# Altium schematic sheet Communication.SchDoc
size A4; SheetNumber: 4; SheetTotal: 5
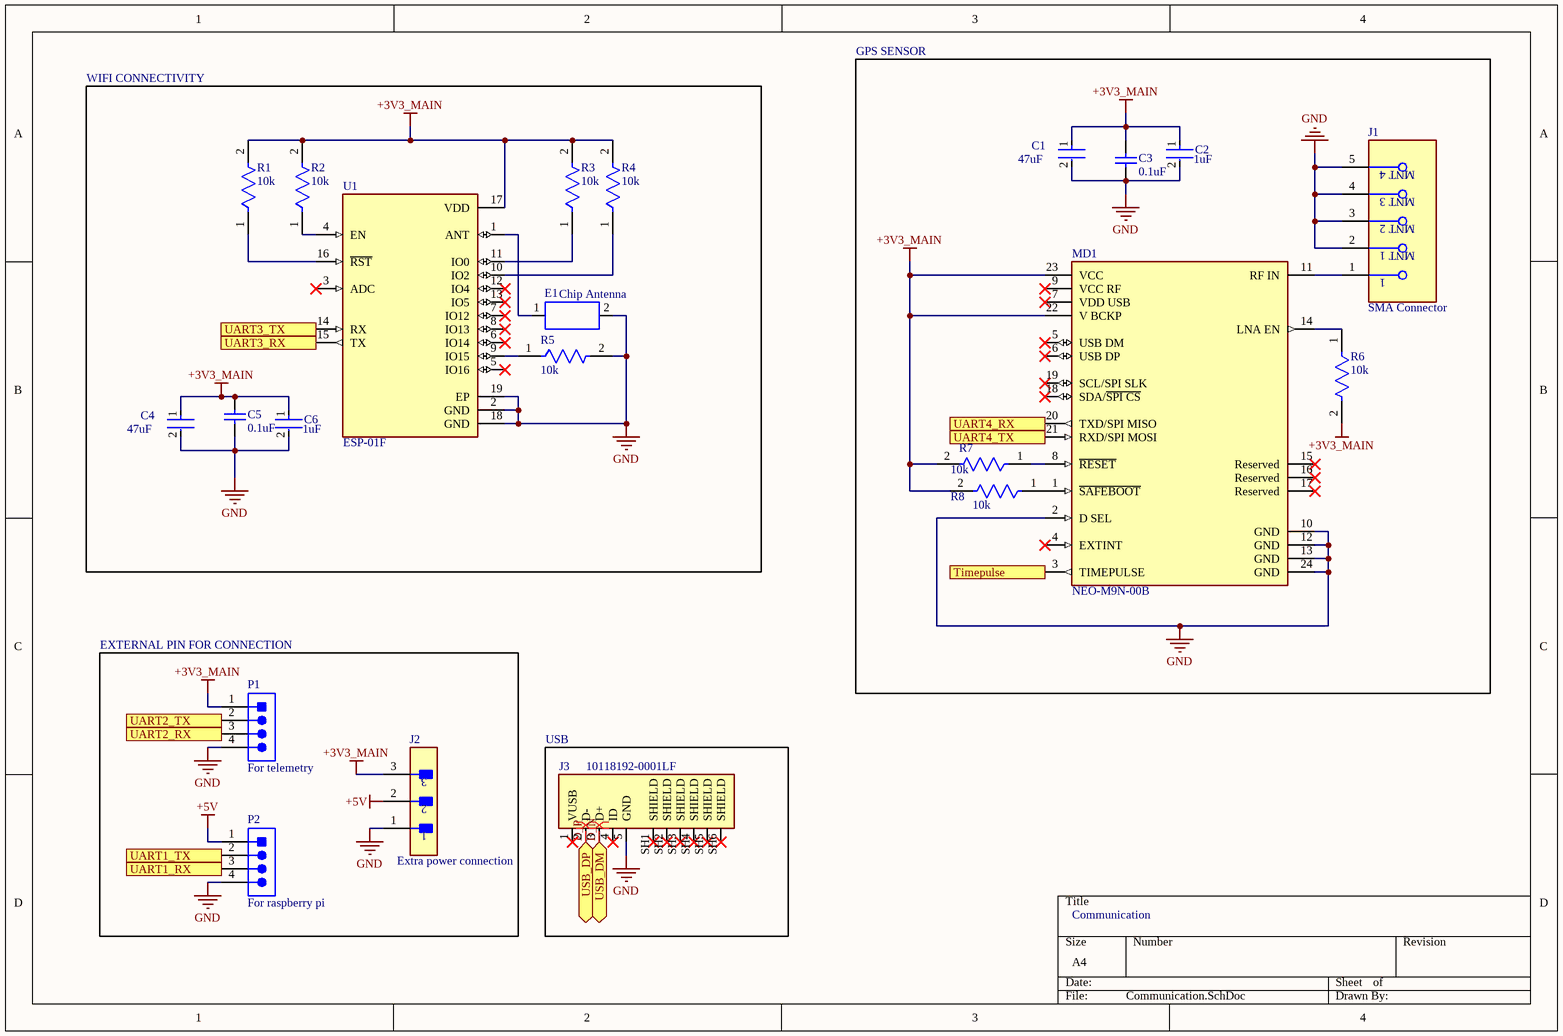
[diagram p0: Communication.SchDoc]

## Parts
C1  47uF  [FP-0603-L_1_6_0_2-W_0_8_0-MFG]
C2  1uF  [FP-GCJ21B-0_3-IPC_B]
C3  0.1uF  [CAPC1608X87X35ML15T15]
C4  47uF  [FP-0603-L_1_6_0_2-W_0_8_0-MFG]
C5  0.1uF  [CAPC1608X87X35ML15T15]
C6  1uF  [FP-GCJ21B-0_3-IPC_B]
E1  Chip Antenna  [TAYO-AH316M-2_M]
J1  SMA Connector  [FP-CON-SMA-EDGE-S-MFG]
J2  Extra power connection  [FP-B3B-XH-AM_LF_SN-MFG]
J3  10118192-0001LF  [AMPHENOL_10118192-0001LF]
MD1  NEO-M9N-00B  [FP-NEO-M9N-00B-MFG]
P1  For telemetry  [JST-B4B-EH-A_V]
P2  For raspberry pi  [JST-B4B-EH-A_V]
R1  10k  [FP-CRGP0805-IPC_C]
R2  10k  [FP-CRGP0805-IPC_C]
R3  10k  [FP-CRGP0805-IPC_C]
R4  10k  [FP-CRGP0805-IPC_C]
R5  10k  [FP-CRGP0805-IPC_C]
R6  10k  [FP-CRGP0805-IPC_C]
R7  10k  [FP-CRGP0805-IPC_C]
R8  10k  [FP-CRGP0805-IPC_C]
U1  ESP-01F  [MODULE_ESP-01F]

## Blocks framed on the sheet
WIFI CONNECTIVITY: C4-C6 E1 R1-R5 U1
GPS SENSOR: C1-C3 J1 MD1 R6-R8
EXTERNAL PIN FOR CONNECTION: J2 P1 P2
USB: J3

## Ports
Timepulse (out, see EMP_FC_Main[3B], MCU_Core[4B]), UART1_RX (out, see EMP_FC_Main[3B], MCU_Core[4B]), UART1_TX (in, see EMP_FC_Main[3B], MCU_Core[4B]), UART2_RX (out, see EMP_FC_Main[3B], MCU_Core[5B]), UART2_TX (in, see EMP_FC_Main[3B], MCU_Core[5B]), UART3_RX (out, see EMP_FC_Main[3B], MCU_Core[1B]), UART3_TX (in, see EMP_FC_Main[3B], MCU_Core[1B]), UART4_RX (out, see EMP_FC_Main[3B], MCU_Core[4B]), UART4_TX (in, see EMP_FC_Main[3B], MCU_Core[4B]), USB_DM (bidir, see EMP_FC_Main[3B], MCU_Core[4B]), USB_DP (bidir, see EMP_FC_Main[3B], MCU_Core[4B])

## Nets
+3V3_MAIN: C1.1 C2.1 C3.2 C4.1 C5.2 C6.1 J2.3 MD1.22(V_BCKP) MD1.23(VCC) P1.1 R1.2 R2.2 R3.2 R4.2 R6.2 R7.2 R8.2 U1.17(VDD)
+5V: J2.2 P2.1
GND: C1.2 C2.2 C3.1 C4.2 C5.1 C6.2 E1.2 J1.2(MNT_1) J1.3(MNT_2) J1.4(MNT_3) J1.5(MNT_4) J2.1 J3.5(GND) MD1.2(D_SEL) MD1.10(GND) MD1.12(GND) MD1.13(GND) MD1.24(GND) P1.4 P2.4 R5.2 U1.2(GND) U1.18(GND) U1.19(EP)
D_N: J3.3(D+) ; port USB_DM
D_P: J3.2(D-) ; port USB_DP
Timepulse: MD1.3(TIMEPULSE) ; port Timepulse
UART1_RX: P2.3 ; port UART1_RX
UART1_TX: P2.2 ; port UART1_TX
UART2_RX: P1.3 ; port UART2_RX
UART2_TX: P1.2 ; port UART2_TX
UART3_RX: U1.15(TX) ; port UART3_RX
UART3_TX: U1.14(RX) ; port UART3_TX
UART4_RX: MD1.20(TXD/SPI_MISO) ; port UART4_RX
UART4_TX: MD1.21(RXD/SPI_MOSI) ; port UART4_TX
NetE1_1: E1.1 U1.1(ANT)
NetJ1_1: J1.1 MD1.11(RF_IN)
NetMD1_1: MD1.1(~{SAFEBOOT}) R8.1
NetMD1_8: MD1.8(~{RESET}) R7.1
NetMD1_14: MD1.14(LNA_EN) R6.1
NetR1_1: R1.1 U1.16(~{RST})
NetR2_1: R2.1 U1.4(EN)
NetR3_1: R3.1 U1.11(IO0)
NetR4_1: R4.1 U1.10(IO2)
NetR5_1: R5.1 U1.9(IO15)

Not connected (* = marked no-connect by the designer): J3 1(VUSB)* 4(ID)* SH1(SHIELD)* SH2(SHIELD)* SH3(SHIELD)* SH4(SHIELD)* SH5(SHIELD)* SH6(SHIELD)*; MD1 4(EXTINT)* 5(USB_DM)* 6(USB_DP)* 7(VDD_USB)* 9(VCC_RF)* 15(Reserved)* 16(Reserved)* 17(Reserved)* 18(SDA/~{SPI_CS})* 19(SCL/SPI_SLK)*; U1 3(ADC)* 5(IO16)* 6(IO14)* 7(IO12)* 8(IO13)* 12(IO4)* 13(IO5)*

## Layout directives
differential pair: D_N, D_P

## Notes on the sheet
- Communication

## Library data of the parts
C1 C4 = CMP-14477-005318-1: Multilayer Ceramic Capacitor 47uF 4V X6S 20% SMD 0603 T/R
C2 C6 = CMP-06035-032003-1: Multilayer Ceramic Capacitors MLCC - SMD/SMT 0805 1uF 10%, 16VDC,  X8L +15/-40%
C3 C5 = CMP-2006-03295-1: Part Number: C0603T104K3RCLTU; Manufacturer: Kemet
E1 = CMP-00025-00001-2: Chip Antenna, 2.4 to 2.5 GHz, -40 to 85 degC, 2-Pin SMD, Pb-Free, Tape and Reel; Manufacturer: Taiyo Yuden; Frequency: 2.45GHz; Impedance: 50Ohm; Manufacturer URL: http://www.t-yuden.com/; Datasheet Version: Sep-15; Min Operating Temperature: -20°C; Mounting Technology: SM; RoHS Compliant: True; Case/Package: AH316M-2; Datasheet URL: http://www.yuden.co.jp/productdata/catalog/en/chipantenna01_e.pdf; Max Operating Temperature: 80°C; Package Quantity: 3000; Pins: 2; Packaging: TapeandReel; Package Description: 2-Pin Surface Mount Device, Body 3.2 x 1.6 mm; Package Reference: AH316M-2
J1 = CMP-204357-000001-1: CONN SMA JACK STR EDGE MNT; Manufacturer Part Number: CON-SMA-EDGE-S; Manufacturer: RF Solutions Ltd.; Impedance: 50Ω; Conn Orientation: Right Angle; Is Female: yes; Number Of Contacts: 1; Frequency: 18GHz; Shielding: true; Category: Conn; ComponentLink2URL: https://www.rfsolutions.co.uk/downloads/1498648656DS-CON-EDGE-SMA-4.pdf; Octopart: https://octopart.com/con-sma-edge-s-rf+solutions-70967450; Package: CONN_JACK; Height: 6.35mm; Device Class L1: Connectors; Footprint Url: https://forum.upverter.com/uploads/default/original/3X/b/e/be75b907af57498775929d6d9099689c472e0307.pdf; Contact Material: Gold; ComponentLink2Description: Datasheet; Device Class L2: RF / Coaxial Connectors; RoHS: TRUE; Device Class L3: unset; Digikey Description: CONN SMA JACK STR EDGE MNT; Lead Free: Yes; Automotive: No
J2 = CMP-17438-000009-1: CONN HEADER VERT 3POS 2.5MM; Max Current Rating: 3A; Gender: Male; Max Voltage Rating (AC): 250V; Connector Type: Male Pin; Pitch: 0.098inch; Number of Positions: 3; Contact Resistance: 20mR; Termination: Press-Fit; Housing Color: White; Housing Material: Polyamide; Orientation: Straight; Contact Material: Brass; Contact Type: Male Pin; Color: Natural; Packaging: Bulk; Lead Free: Lead Free; Depth: 5.75mm; Number of Rows: 1; Contact Plating: Tin; Length: 9.9mm; Max Operating Temperature: 85°C; Series: XH; Min Operating Temperature: -25°C; Fastening Type: Detent; Mount: Through Hole
J3 = 10118192-0001LF: Micro USB, Input Output Connectors, B TYPE RECEPTACLE with flange; MF: Amphenol ICC; Check_prices: https://www.snapeda.com/parts/10118192-0001LF/Amphenol+FCI/view-part/?ref=eda; Value: *; Availability: In Stock; MP: 10118192-0001LF; Price: None; Package: None; Purchase-URL: https://pricing.snapeda.com/search/part/10118192-0001LF/?ref=eda; SnapEDA_Link: https://www.snapeda.com/parts/10118192-0001LF/Amphenol+FCI/view-part/?ref=snap
MD1 = CMP-207130-000006-2: M9 standard precision module; Manufacturer: u-blox; Min Supply Voltage: 1.65V; Sensitivity: -167dBm; Interface: I2C,SPI,UART,USB; Max Supply Voltage: 3.6V; Device Class L3: RF Receivers; Category: UNK; Temperature Range Low: -40°C; Temperature Range High: +85°C; ComponentLink2Description: Datasheet; Manufacturer Part Number: NEO-M9N-00B; ComponentLink2URL: https://www.u-blox.com/sites/default/files/NEO-M9N_DataSheet_%28UBX-19014285%29.pdf; Footprint Url: https://www.u-blox.com/sites/default/files/NEO-M9N_Integrationmanual_%28UBX-19014286%29.pdf; Height: 2.6mm; Automotive: No; RoHS: TRUE; Lead Free: Yes; Octopart: https://octopart.com/neo-m9n-00b-u-blox-107315722; Package: 0; Temperature: -40°C to +85°C; Device Class L1: Integrated Circuits (ICs); Device Class L2: RF Semiconductors and Devices
P1 P2 = CMP-2000-05904-1: Male Header, Pitch 2.5 mm, 1 x 4 Position, Height 6 mm, Tail Length 3.2 mm, -25 to 85 degC, RoHS, Bulk; Manufacturer: JST; Style/Orientation: StraightHeader/Plug; Pitch: 2.5mm; No of Positions: 4; Mounting Technology: SurfaceMount; Package Description: Male Header, Pitch 2.5 mm, 1 x 4 Position, Height 6 mm, Tail Length 3.2 mm; Datasheet Version: 12/2012; Type: ShroudedHeader; Package Reference: B4B-EH-A; Manufacturer URL: http://www.jst.com/home2.html; Termination: Crimp; Datasheet URL: http://www.jst-mfg.com/product/pdf/eng/eEH.pdf
R1-R8 = CMP-03211-006861-1: CRGP 0805 10K 1%; Manufacturer Part Number: CRGP0805F10K; Manufacturer: TE; Power Rating: 0.33W; Voltage Rating: 150V; Value: 10KΩ; Tolerance: 0.01; Temperature Coefficient: ±100ppm/°C; ComponentLink2URL: https://www.mouser.com/datasheet/2/418/NG_DS_9-1773463-9_A-1358566.pdf; Temperature Range Low: -55°C; Ipc Land Pattern Name: RESC200125X55; Device Class L2: Resistors; Automotive: No; Device Class L3: Chip SMD Resistors; Composition: Thick Film; Temperature Range High: +155°C; Temperature: -55°C to +155°C; Height: 0.65mm; Series: CRGP; RoHS: TRUE; Device Class L1: Passive Components; Octopart: https://octopart.com/crgp0805f10k-te+connectivity-91018782; Package: CRGP0805; Digikey Description: CRGP 0805 10K 1%; Ambient Temperature Range High: +70°C; Lead Free: Yes; ComponentLink2Description: Datasheet; Category: Res; Resistance: 10KΩ
U1 = ESP-01F: 802.11b/g/n Wi-Fi SOC module; MF: AI-Thinker; SnapEDA_Link: https://www.snapeda.com/parts/ESP-01F/AI-Thinker/view-part/?ref=snap; Package: None; Value: *; MP: ESP-01F; Check_prices: https://www.snapeda.com/parts/ESP-01F/AI-Thinker/view-part/?ref=eda